# EAGLE schematic CAN Star (EAGLE 8.7.0)
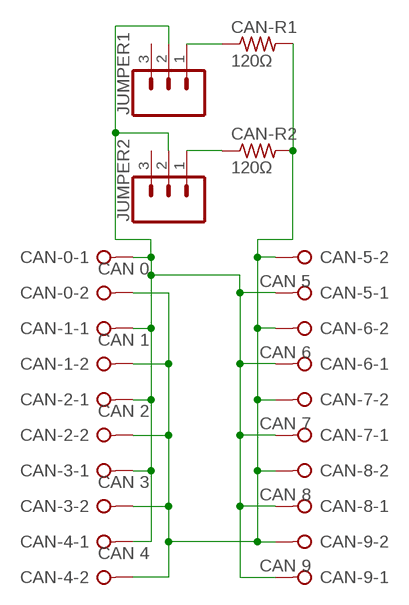
[diagram p0: schematic, sheet 1]

## Parts
CAN-0  CAN 0  W237-02P  [W237-132]
CAN-1  CAN 1  W237-02P  [W237-132]
CAN-2  CAN 2  W237-02P  [W237-132]
CAN-3  CAN 3  W237-02P  [W237-132]
CAN-4  CAN 4  W237-02P  [W237-132]
CAN-5  CAN 5  W237-02P  [W237-132]
CAN-6  CAN 6  W237-02P  [W237-132]
CAN-7  CAN 7  W237-02P  [W237-132]
CAN-8  CAN 8  W237-02P  [W237-132]
CAN-9  CAN 9  W237-02P  [W237-132]
CAN-R1  120Ω  R-US_0207/10  [0207/10]
CAN-R2  120Ω  R-US_0207/10  [0207/10]
JUMPER1  CONN_03  [1X03]
JUMPER2  CONN_03  [1X03]

## Nets
CAN-A: CAN-0.1 CAN-1.1 CAN-2.1 CAN-3.1 CAN-4.1 CAN-5.1 CAN-6.1 CAN-7.1 CAN-8.1 CAN-9.1 JUMPER1.2 JUMPER2.2
CAN-B: CAN-0.2 CAN-1.2 CAN-2.2 CAN-3.2 CAN-4.2 CAN-5.2 CAN-6.2 CAN-7.2 CAN-8.2 CAN-9.2 CAN-R1.2 CAN-R2.2
N$1: CAN-R1.1 JUMPER1.1
N$2: CAN-R2.1 JUMPER2.1
Unconnected: JUMPER1.3 JUMPER2.3

## Library data of the parts
CAN-0 CAN-1-CAN-9 = con-wago-508:W237-02P: WAGO SREW CLAMP; OC_FARNELL: unknown; OC_NEWARK: unknown
CAN-R1 CAN-R2 = resistor:R-US_: RESISTOR, American symbol
JUMPER1 JUMPER2 = SparkFun-Connectors:CONN_03: Multi connection point. Often used as Generic Header-pin footprint for 0.1 inch spaced/style header connections On any of the 0.1 inch spaced packages, you can populate with these: Break Away Headers - Straight <https://www.sparkfun.com/products/116> (PRT-00116) Break Away Male Headers - Right Angle <https://www.sparkfun.com/products/553> (PRT-00553) Female Headers <https://www.sparkfun.com/products/115> (PRT-00115) Break Away Headers - Machine Pin <https://www.sparkfun.com/products/117> (PRT-00117) Break Away Female Headers - Swiss Machine Pin <https://www.sparkfun.com/products/743> (PRT-00743) Stackable Header - 3 Pin (Female, 0.1") <https://www.sparkfun.com/products/13875> (PRT-13875) For SCREWTERMINALS and SPRING TERMINALS visit here: Screw Terimnals on SparkFun.com <https://www.sparkfun.com/search/results?term=Screw+Terminals> (5mm/3.5mm/2.54mm spacing) This device is also useful as a general connection point to wire up your design to another part of your project. Our various solder wires solder well into these plated through hole pads. Hook-Up Wire - Assortment (Stranded, 22 AWG) <https://www.sparkfun.com/products/11375> (PRT-11375) Hook-Up Wire - Assortment (Solid Core, 22 AWG) <https://www.sparkfun.com/products/11367> (PRT-11367) View the entire wire category on our website here <https://www.sparkfun.com/categories/141> Special notes: Molex polarized connector foot print use with SKU : PRT-08232 with associated crimp pins and housings.